# EAGLE design v3.0.0_programmer (EAGLE 8.1.0)
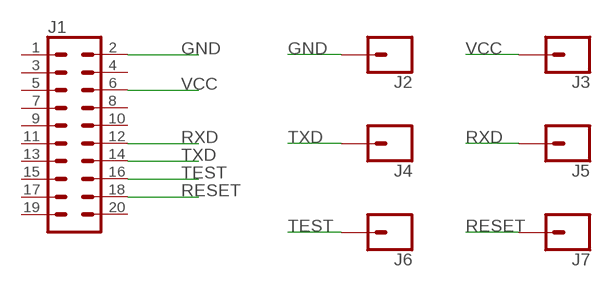
[diagram p0: schematic, sheet 1]

## Parts
J1  CONN_10X2NOSILK  [2X10_NOSILK]
J2  CONN_01  [1X01]
J3  CONN_01  [1X01]
J4  CONN_01  [1X01]
J5  CONN_01  [1X01]
J6  CONN_01  [1X01]
J7  CONN_01  [1X01]

## Nets
GND: J1.2 J2.1
RESET: J1.18 J7.1
RXD: J1.12 J5.1
TEST: J1.16 J6.1
TXD: J1.14 J4.1
VCC: J1.6 J3.1
Unconnected: J1.1 J1.3 J1.4 J1.5 J1.7 J1.8 J1.9 J1.10 J1.11 J1.13 J1.15 J1.17 J1.19 J1.20

## Library data of the parts
J1 = SparkFun-Connectors:CONN_10X2: Multi connection point. Often used as Generic Header-pin footprint for 0.1 inch spaced/style header connections On any of the 0.1 inch spaced packages, you can populate with these: Break Away Headers - Straight <https://www.sparkfun.com/products/116> (PRT-00116) Break Away Male Headers - Right Angle <https://www.sparkfun.com/products/553> (PRT-00553) Female Headers <https://www.sparkfun.com/products/115> (PRT-00115) Break Away Headers - Machine Pin <https://www.sparkfun.com/products/117> (PRT-00117) Break Away Female Headers - Swiss Machine Pin <https://www.sparkfun.com/products/743> (PRT-00743) Special note about the "SPECIAL" package: This was SPECIALLY designed to be used with our Graphic LCD Backpack. Be sure you want to use this! It is not only staggered on each line of header holes, but IT IS ALSO offset of the center point of the top and bottom lines by 5 mil. This causes the headers to lock into place on the "standard" footprint on the LCD screen. The extra squares on the tdocu layer are there simply to reference other pins (if you were to actually populate a longer header than ten long - this is what we do with the backpacks).
J2-J7 = SparkFun-Connectors:CONN_01: Single connection point. Often used as Generic Header-pin footprint for 0.1 inch spaced/style header connections On any of the 0.1 inch spaced packages, you can populate with these: Break Away Headers - Straight <https://www.sparkfun.com/products/116> (PRT-00116) Break Away Male Headers - Right Angle <https://www.sparkfun.com/products/553> (PRT-00553) Female Headers <https://www.sparkfun.com/products/115> (PRT-00115) Break Away Headers - Machine Pin <https://www.sparkfun.com/products/117> (PRT-00117) Break Away Female Headers - Swiss Machine Pin <https://www.sparkfun.com/products/743> (PRT-00743) This device is also useful as a general connection point to wire up your design to another part of your project. Our various solder wires solder well into these plated through hole pads. Hook-Up Wire - Assortment (Stranded, 22 AWG) <https://www.sparkfun.com/products/11375> (PRT-11375) Hook-Up Wire - Assortment (Solid Core, 22 AWG) <https://www.sparkfun.com/products/11367> (PRT-11367) View the entire wire category on our website here <https://www.sparkfun.com/categories/141> Special notes: SMTSO-256-ET is a "flush mount" nut for a 4-40 screw. We mostly use this on specialty testbeds; it is a nice way to connect hardware to your PCB at an adjustable hieght. Also note, the SNAP packages are for using a snappable style connector. We sell a baggie of snaps and they are also used on two LilyPad designs: Snap Assortment - 30 pack (male and female) <https://www.sparkfun.com/products/11347> (DEV-11347) LilyPad Arduino SimpleSnap <https://www.sparkfun.com/products/10941> (DEV-10941) LilyPad SimpleSnap Protoboard <https://www.sparkfun.com/products/10940> (DEV-10940)

## Board
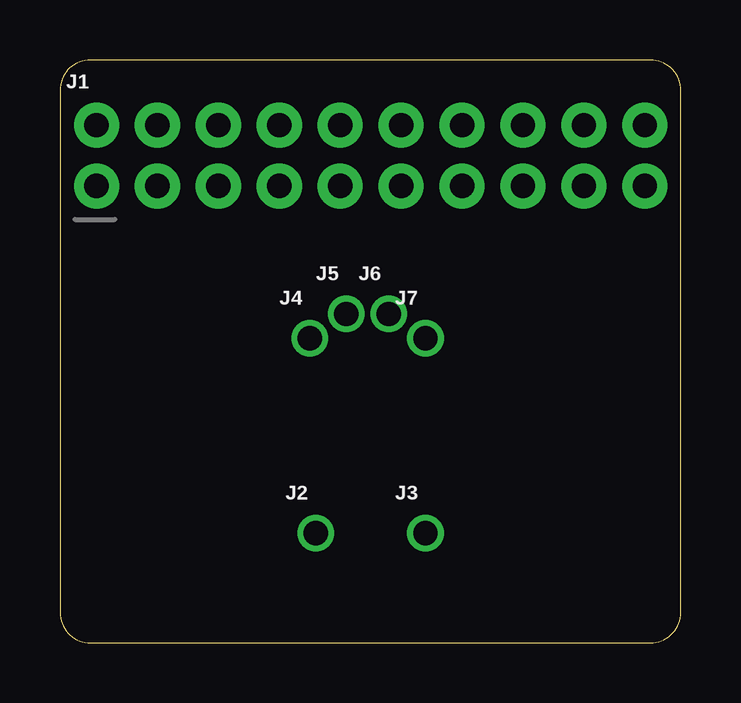
[diagram p1: board, top side]
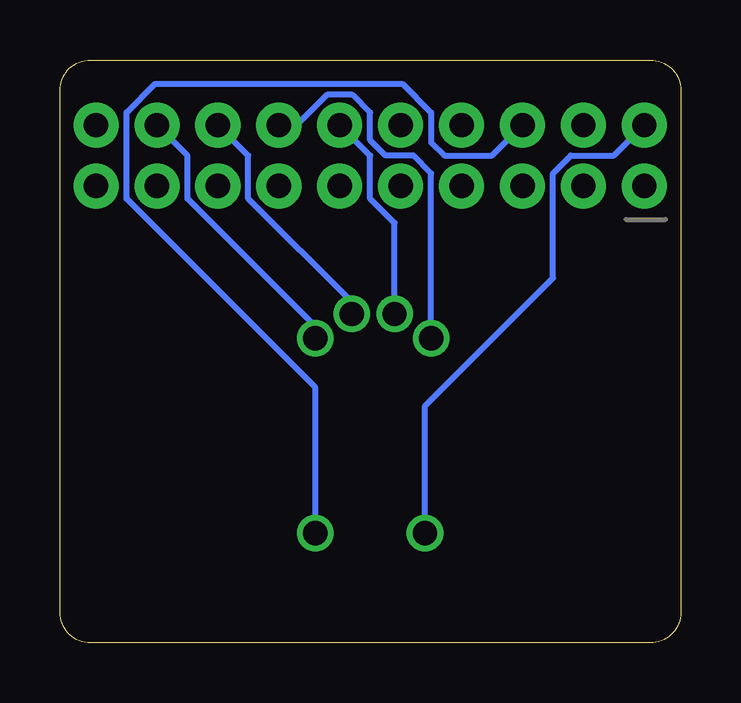
[diagram p2: board, bottom side, seen from below]

Size 25.89 x 24.31 mm. Coordinates in mm from the lower left corner, seen from the top.
Outline: 0,23.04 0,1.27 arc90 1.27,0 24.62,0 arc90 25.89,1.27 25.89,23.04 arc90 24.62,24.31 1.27,24.31 arc90 0,23.04
Copper layers (1*16): Top 0.035mm / dielectric 1.5mm / Bottom 0.035mm
Design rules "default": minimum track width 10mil, minimum drill 24mil, track to track 8mil, track to pad 8mil, pad to pad 8mil, via to via 8mil, smd to smd 8mil, copper to edge 40mil, drill to drill 8mil, minimum pad ring 10mil, minimum via ring 8mil, stop-mask expansion 4mil, vias tented up to drill 0mil, thermal gap 10mil

### Footprints (pad centres in the part's own frame; a part is rotated, then mirrored left to right if it is on the bottom)
2X10_NOSILK = drill 1.016 pad 1.88: 1 0,0; 2 0,2.54; 3 2.54,0; 4 2.54,2.54; 5 5.08,0; 6 5.08,2.54; 7 7.62,0; 8 7.62,2.54; 9 10.16,0; 10 10.16,2.54; 11 12.7,0; 12 12.7,2.54; 13 15.24,0; 14 15.24,2.54; 15 17.78,0; 16 17.78,2.54; 17 20.32,0; 18 20.32,2.54; 19 22.86,0; 20 22.86,2.54
1X01 = drill 1.016 pad 1.27: 1 0,0

### Placement (x,y rotation side)
J1  1.52,19.05 0 top
J2  10.67,4.57 0 top
J3  15.24,4.57 0 top
J4  10.41,12.7 0 top
J5  11.94,13.72 0 top
J6  13.72,13.72 0 top
J7  15.24,12.7 0 top

### Tracks (layer width: path | path; a pad name or v marks a point on that pad's centre or on a via)
GND
  Bottom 0.254: J2.1 10.67,9.88 5.33,15.22 5.33,19.58 4.59,20.32 2.79,20.32 J1.2
RESET
  Bottom 0.254: J1.18 20.57,20.32 20.57,18.52 15.24,13.19 J7.1
RXD
  Bottom 0.254: J5.1 11.94,17.51 12.95,18.52 12.95,20.32 J1.12
TEST
  Bottom 0.254: J1.16 18.03,20.32 18.03,18.52 13.72,14.21 J6.1
TXD
  Bottom 0.254: J4.1 10.41,19.58 11.16,20.32 12.31,20.32 12.95,20.97 12.95,22.12 13.7,22.86 14.75,22.86 16.02,21.59 J1.14
VCC
  Bottom 0.254: J1.6 7.87,20.32 9.87,20.32 10.41,20.87 10.41,22.12 11.62,23.32 21.91,23.32 23.11,22.12 23.11,18.52 15.24,10.65 J3.1

### Text on the board
tStop: Barologger v3.0.0 ISP Programmer